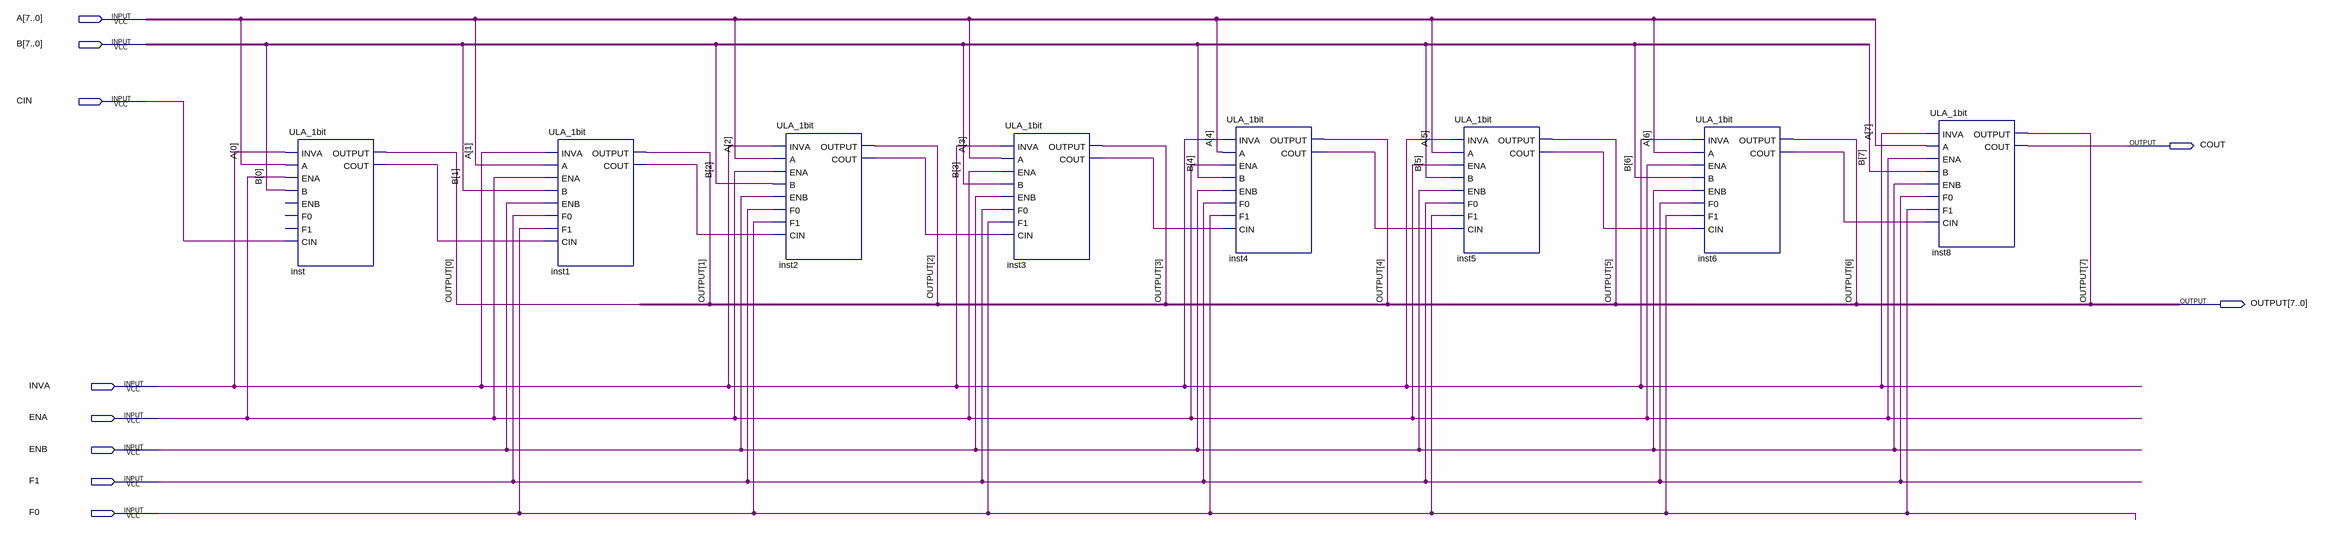
[diagram p0: schematic sheet]
// Quartus schematic ULA_8bit.bdf as structural Verilog: 8 symbols, 10 pins
module ULA_8bit (
  input  [7:0] A,
  input  [7:0] B,
  input  CIN,
  input  INVA,
  input  ENA,
  input  ENB,
  input  F1,
  input  F0,
  output COUT,
  output [7:0] OUTPUT
);

  wire inst1_cout, inst2_cout, inst3_cout, inst4_cout, inst5_cout, inst6_cout, inst_cout;

  ULA_1bit inst (
    .INVA(INVA), .A(A[0]), .ENA(ENA), .B(B[0]), .CIN(CIN), .OUTPUT(OUTPUT[0]), .COUT(inst_cout));  // open: ENB, F0, F1
  ULA_1bit inst1 (
    .INVA(INVA), .A(A[1]), .ENA(ENA), .B(B[1]), .ENB(ENB), .F0(F1), .F1(F0), .CIN(inst_cout),
    .OUTPUT(OUTPUT[1]), .COUT(inst1_cout));
  ULA_1bit inst2 (
    .INVA(INVA), .A(A[2]), .ENA(ENA), .B(B[2]), .ENB(ENB), .F0(F1), .F1(F0), .CIN(inst1_cout),
    .OUTPUT(OUTPUT[2]), .COUT(inst2_cout));
  ULA_1bit inst3 (
    .INVA(INVA), .A(A[3]), .ENA(ENA), .B(B[3]), .ENB(ENB), .F0(F1), .F1(F0), .CIN(inst2_cout),
    .OUTPUT(OUTPUT[3]), .COUT(inst3_cout));
  ULA_1bit inst4 (
    .INVA(INVA), .A(A[4]), .ENA(ENA), .B(B[4]), .ENB(ENB), .F0(F1), .F1(F0), .CIN(inst3_cout),
    .OUTPUT(OUTPUT[4]), .COUT(inst4_cout));
  ULA_1bit inst5 (
    .INVA(INVA), .A(A[5]), .ENA(ENA), .B(B[5]), .ENB(ENB), .F0(F1), .F1(F0), .CIN(inst4_cout),
    .OUTPUT(OUTPUT[5]), .COUT(inst5_cout));
  ULA_1bit inst6 (
    .INVA(INVA), .A(A[6]), .ENA(ENA), .B(B[6]), .ENB(ENB), .F0(F1), .F1(F0), .CIN(inst5_cout),
    .OUTPUT(OUTPUT[6]), .COUT(inst6_cout));
  ULA_1bit inst8 (
    .INVA(INVA), .A(A[7]), .ENA(ENA), .B(B[7]), .ENB(ENB), .F0(F1), .F1(F0), .CIN(inst6_cout),
    .OUTPUT(OUTPUT[7]), .COUT(COUT));
endmodule
